# Altium schematic sheet Microphone_Amplifier.SchDoc
size A3; DocumentNumber: 4; SheetNumber: 2; SheetTotal: 18
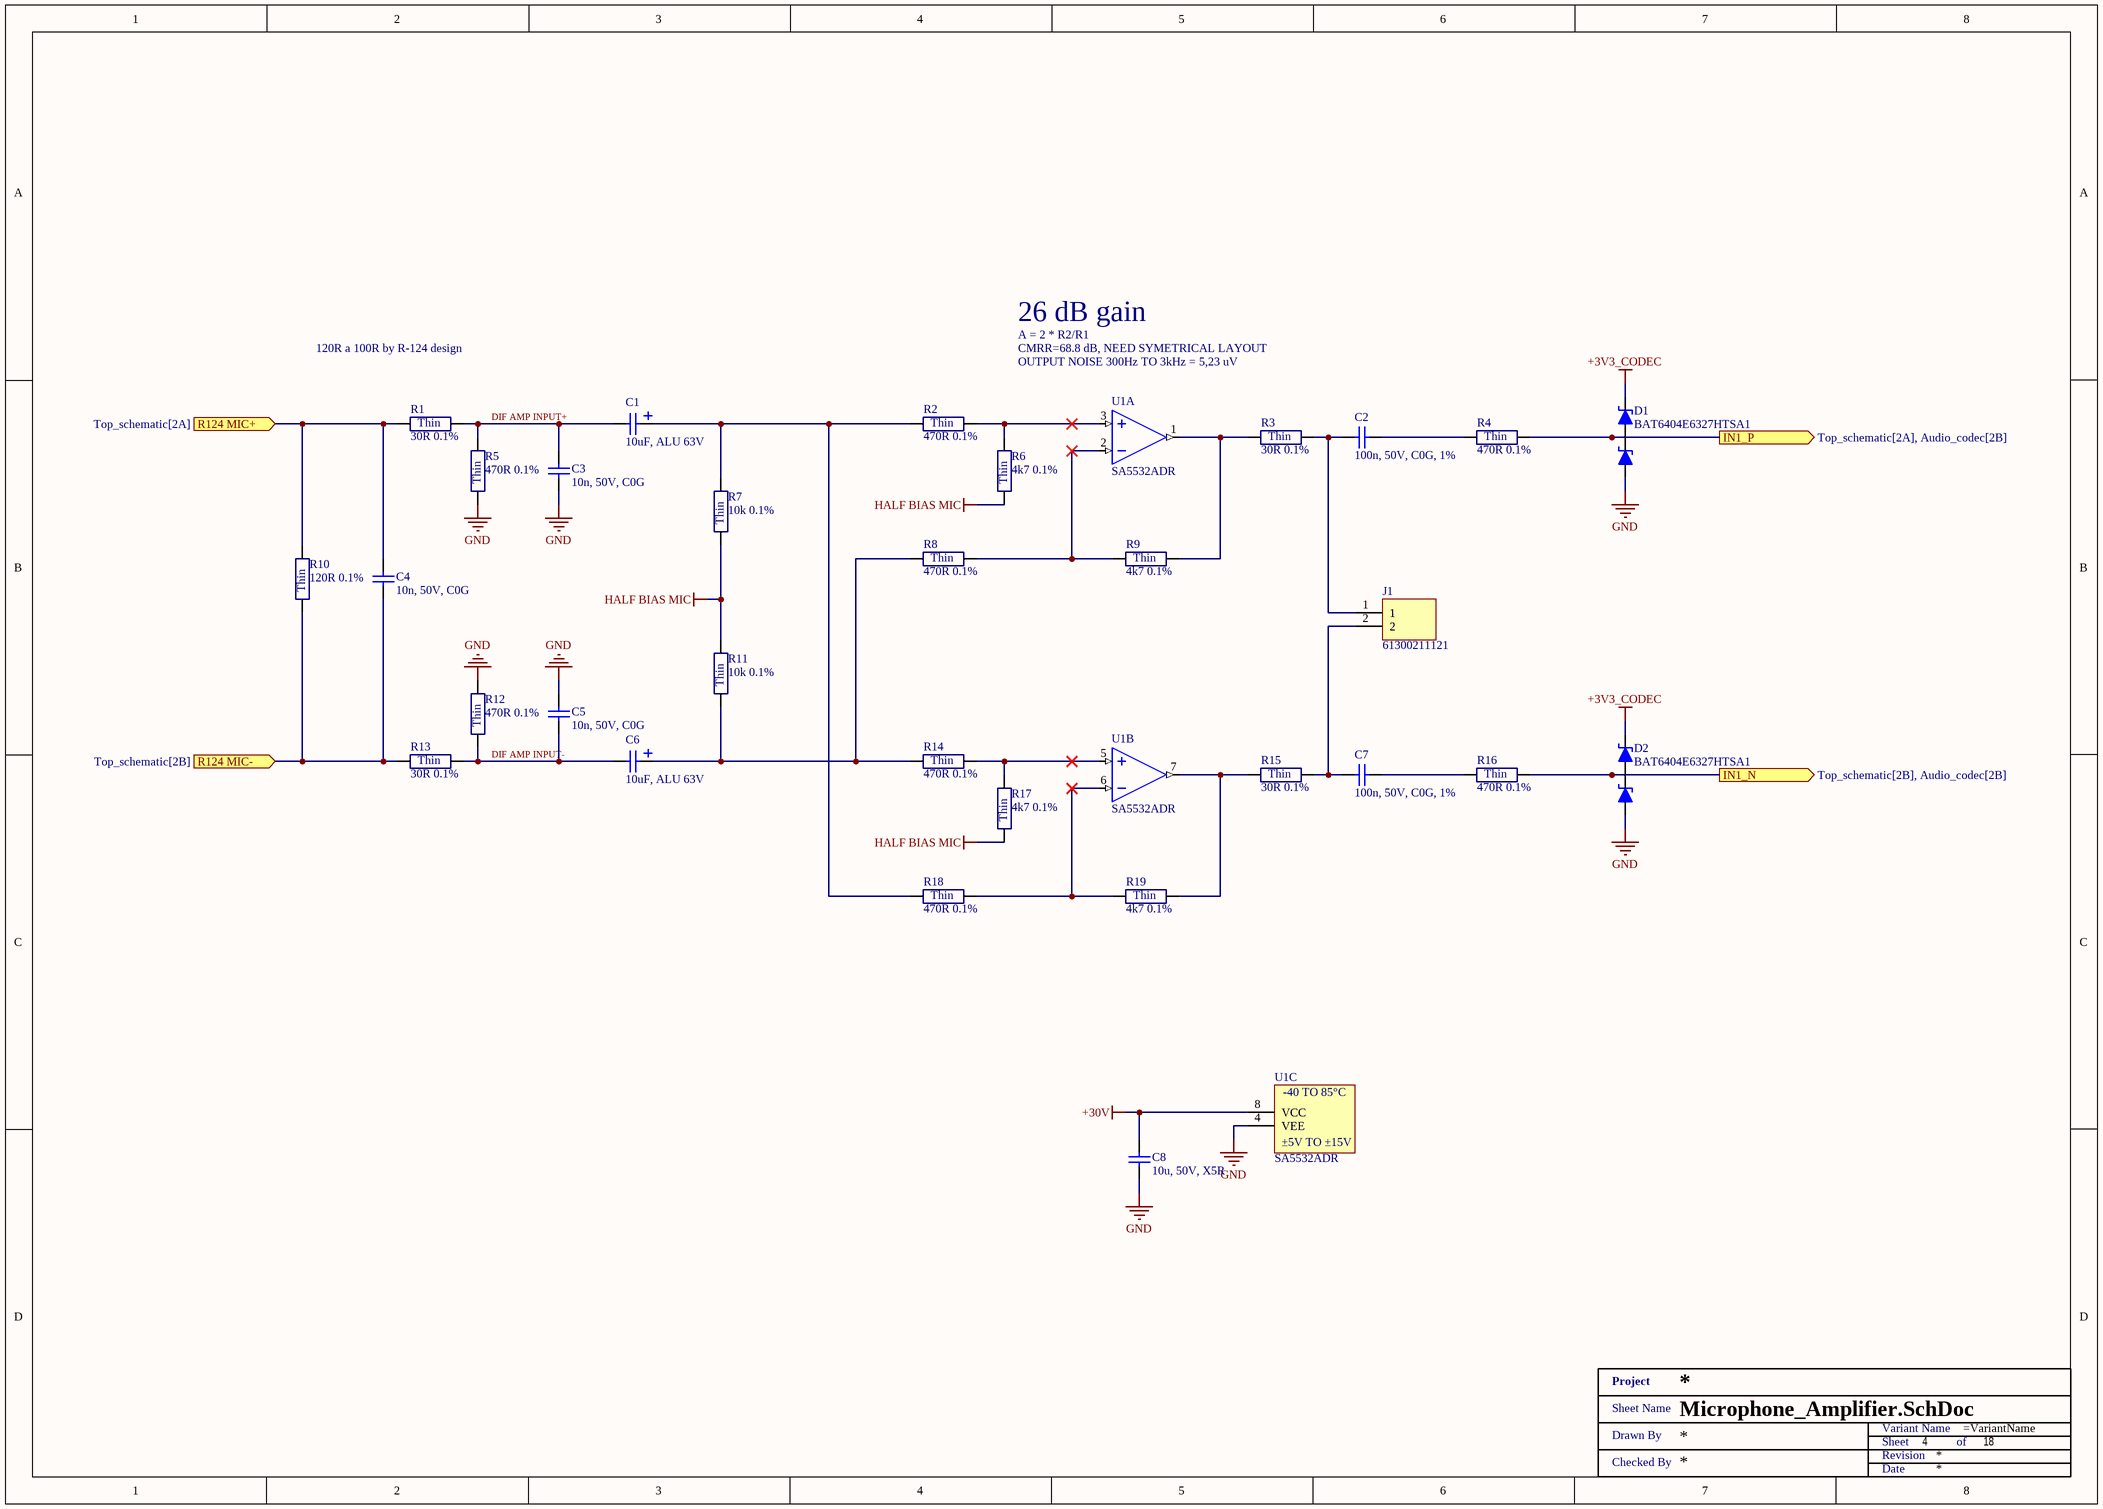
[diagram p0: Microphone_Amplifier.SchDoc]

## Parts
C1  10uF, ALU 63V  [WCAP-ATLI_5x11x2]
C2  100n, 50V, C0G, 1%  [SMD1206]
C3  10n, 50V, C0G  [SMD0603]
C4  10n, 50V, C0G  [SMD0603]
C5  10n, 50V, C0G  [SMD0603]
C6  10uF, ALU 63V  [WCAP-ATLI_5x11x2]
C7  100n, 50V, C0G, 1%  [SMD1206]
C8  10u, 50V, X5R  [SMD1206]
D1  BAT6404E6327HTSA1  [SOT23 (TO-236AB)]
D2  BAT6404E6327HTSA1  [SOT23 (TO-236AB)]
J1  61300211121  [Header 2 2.54mm]
R1  30R 0.1%  [SMD0402 - R]
R2  470R 0.1%  [SMD0402 - R]
R3  30R 0.1%  [SMD0402 - R]
R4  470R 0.1%  [SMD0402 - R]
R5  470R 0.1%  [SMD0402 - R]
R6  4k7 0.1%  [SMD0402 - R]
R7  10k 0.1%  [SMD0402 - R]
R8  470R 0.1%  [SMD0402 - R]
R9  4k7 0.1%  [SMD0402 - R]
R10  120R 0.1%  [SMD0402 - R]
R11  10k 0.1%  [SMD0402 - R]
R12  470R 0.1%  [SMD0402 - R]
R13  30R 0.1%  [SMD0402 - R]
R14  470R 0.1%  [SMD0402 - R]
R15  30R 0.1%  [SMD0402 - R]
R16  470R 0.1%  [SMD0402 - R]
R17  4k7 0.1%  [SMD0402 - R]
R18  470R 0.1%  [SMD0402 - R]
R19  4k7 0.1%  [SMD0402 - R]
U1  SA5532ADR  [SOIC08]  (parts A,B,C of 3)
XX?  Title 1  (value not drawn)  (graphical)

## Ports
IN1_N (out, see Top_schematic[2B], Audio_codec[2B]), IN1_P (out, see Top_schematic[2A], Audio_codec[2B]), R124 MIC+ (in, see Top_schematic[2A]), R124 MIC- (in, see Top_schematic[2B])

## Nets
+3V3_CODEC: D1.2(C) D2.2(C)
+30V: C8.2 U1.8(VCC)
GND: C3.1 C5.2 C8.1 D1.1(A) D2.1(A) R5.1 R12.2 U1.4(VEE)
HALF BIAS MIC: R6.1 R7.1 R11.2 R17.1
DIF AMP INPUT+: C1.2 C3.2 R1.2 R5.2
DIF AMP INPUT-: C5.1 C6.2 R12.1 R13.2
IN1_N: D2.3(C) R16.2 ; port IN1_N
IN1_P: D1.3(C) R4.2 ; port IN1_P
R124 MIC+: C4.2 R1.1 R10.2 ; port R124 MIC+
R124 MIC-: C4.1 R10.1 R13.1 ; port R124 MIC-
NetC1_1: C1.1 R2.1 R7.2 R18.1
NetC2_1: C2.1 J1.1 R3.2
NetC2_2: C2.2 R4.1
NetC6_1: C6.1 R8.1 R11.1 R14.1
NetC7_1: C7.1 J1.2 R15.2
NetC7_2: C7.2 R16.1
NetR2_2: R2.2 R6.2 U1.3(+IN_A)
NetR3_1: R3.1 R9.2 U1.1(OUT_A)
NetR8_2: R8.2 R9.1 U1.2(-IN_A)
NetR14_2: R14.2 R17.2 U1.5(+IN_B)
NetR15_1: R15.1 R19.2 U1.7(OUT_B)
NetR18_2: R18.2 R19.1 U1.6(-IN_B)

## Notes on the sheet
- 120R a 100R by R-124 design
- 26 dB gain
- A = 2 * R2/R1
- CMRR=68.8 dB, NEED SYMETRICAL LAYOUT
- OUTPUT NOISE 300Hz TO 3kHz = 5,23 uV
- (in symbol RT0402BRD074K7L) Thin
- (in symbol RT0402BRE07120RL) Thin
- (in symbol RT0402BRE07470RL) Thin
- (in symbol SA5532ADR, part C) -40 TO 85°C; ±5V TO ±15V
- (in symbol TC0225B300JTCC) Thin
- (in symbol TC0225B1002TCC) Thin
- (in symbol Title 1) Project; Sheet Name; Variant Name; Drawn By; Sheet; of; Revision; Checked By; Date

## Library data of the parts
C1 C6 = 860080772001: WURTH ELEKTRONIK - 860080772001 - CAP, ALU ELEC, 10UF, 63V, RADIAL; Ripple Current: 135mA @ 100kHz; Capacitance: 10u; Manufacturer: WURTH ELEKTRONIK; Manufacturer Part Number: 860080772001; RoHS: YES; Stock 1: 553; Pricing 1: 1=0.0957, 3=0.091, 5=0.0863, 10=0.0825, 20=0.0786, 50=0.0692, 250=0.0647, 500=0.0564 (GBP); ComponentLink1URL: http://www.farnell.com/datasheets/1879798.pdf; ComponentLink1Description: http://www.farnell.com/datasheets/1879798.pdf; Voltage Rating: 63V; Stock 3: 2136; Pricing 3: 1=0.62, 50=0.335, 100=0.289, 250=0.259, 500=0.235, 1500=0.202, 7500=0.182, 15000=0.178 (GBP); ComponentLink2URL: http://www.farnell.com/datasheets/2065186.pdf; ComponentLink2Description: http://www.farnell.com/datasheets/2065186.pdf; Supplier 1: Mouser; Supplier Part Number 1: 710-860080772001; Supplier 2: Farnell; Supplier Part Number 2: 2465955; Supplier 3: Digi-Key; Supplier Part Number 3: 732-9121-1-ND
C2 C7 = GCM31C5C1H104FA16L: CAP CER 0.1UF 50V C0G/NP0 1206 1%; Manufacturer: Murata; Supplier 1: Mouser; Supplier Part Number 1: 81-GCM31C5C1H104FA16; Manufacturer Part Number: GCM31C5C1H104FA16L; RoHS: No; Stock 1: 9381; Pricing 1: 1=1,24000, 10=0,98200, 25=0,90100, 100=0,73700, 250=0,59000, 500=0,55700 (USD); Supplier 2: Digi-Key; Supplier Part Number 2: 490-GCM31C5C1H104FA16LCT-ND; Supplier 3: Future Electronics; Supplier Part Number 3: GCM31C5C1H104FA16L-CUTT; Capacitance: 100n
C3-C5 = GRM1885C1H103JA01D: Multilayer Ceramic Capacitors MLCC - SMD/SMT 0603 50VDC 10000pF 5% C0G; Manufacturer: Murata Electronics; Type: Chip Multilayer Ceramic Capacitor for General Purpose; Capacitance - nF: 10 nF; Class: Class 1; CNHTS: 8532241000; Dielectric: C0G (NP0); TARIC: 8532240000; Supplier 1: Mouser; Supplier Part Number 1: 81-GRM1885C1H103JA1D; Manufacturer Part Number: GRM1885C1H103JA01D; RoHS: RoHS Compliant; Category: Multilayer Ceramic Capacitors MLCC - SMD/SMT; Stock 1: 217291; Pricing 1: 1=0.183, 10=0.129, 100=0.065, 500=0.045, 1000=0.039, 4000=0.030, 8000=0.027, 24000=0.025 (EUR); Capacitance: 10n; Height: 0.8 mm; Length: 1.6 mm; Package / Case: 0603 (1608 metric); Packaging: Cut Tape; Product: General Type MLCCs; Series: GRM; Termination Style: SMD/SMT; Tolerance: 5 %; Voltage Rating DC: 50 VDC; Width: 0.8 mm; Brand: Murata Electronics; Capacitance - pF: 10000 pF; Case Code - in: 0603; Case Code - mm: 1608; HTS Code: 8532240020; Maximum Operating Temperature: + 125 C; Minimum Operating Temperature: - 55 C; Product Type: Ceramic Capacitors; Standard Pack Qty: 4000; Subcategory: Capacitors; Termination: Standard; RoHS - Mouser: Y; Minimum Order Quantity: 1; Reeling: True; ComponentLink1URL: http://www.mouser.com/datasheet/2/281/murata_03052018_GRM_Series_1-1310166.pdf; ComponentLink1Description: http://www.mouser.com/datasheet/2/281/murata_03052018_GRM_Series_1-1310166.pdf; Supplier 2: Farnell; Supplier Part Number 2: 2456107
C8 = UMK316BBJ106KL-T: CAP CER 10UF 50V X5R 1206; Manufacturer: Taiyo Yuden; Tolerance: 10%; Supplier 1: Mouser; Supplier Part Number 1: 963-UMK316BBJ106KL-T; Manufacturer Part Number: UMK316BBJ106KL-T; RoHS: Yes; Category: Ceramic Capacitors; Stock 1: 207945; Pricing 1: 1=0,42000, 10=0,18000, 100=0,12800, 500=0,11000, 1000=0,09700, 2000=0,08000 (USD); Mount: Surface Mount; Case/Package: 1206; Min Operating Temperature: -55°C; Max Operating Temperature: 85°C; Packaging: Tape and Reel; Capacitance: 10u; Voltage Rating: 50V; Length: 0.126inch; Width: 0.063inch; Thickness: 0.071inch; Lead Free: Lead Free; ComponentLink1URL: http://ds.yuden.co.jp/TYCOMPAS/ut/detail.do?productNo=UMK316BBJ106KL-T&fileName=UMK316BBJ106KL-T_SS&mode=specSheetDownload&src-supplier=Digi-Key; ComponentLink1Description: http://ds.yuden.co.jp/TYCOMPAS/ut/detail.do?productNo=UMK316BBJ106KL-T&fileName=UMK316BBJ106KL-T_SS&mode=specSheetDownload&src-supplier=Digi-Key; ComponentLink2URL: https://www.yuden.co.jp/productdata/catalog/mlcc01_e.pdf?src-supplier=Digi-Key; ComponentLink2Description: https://www.yuden.co.jp/productdata/catalog/mlcc01_e.pdf?src-supplier=Digi-Key; ComponentLink3URL: http://www.yuden.co.jp/productdata/catalog/en/mlcc_all_e.pdf?src-supplier=Digi-Key; ComponentLink3Description: http://www.yuden.co.jp/productdata/catalog/en/mlcc_all_e.pdf?src-supplier=Digi-Key; Supplier 2: Digi-Key; Supplier Part Number 2: 587-5960-1-ND; Supplier 3: Avnet; Supplier Part Number 3: UMK316BBJ106KL-T
D1 D2 = BAT6404E6327HTSA1: Infineon 40V 250mA, Rectifier & Schottky Diode, SOT-23 BAT6404E6327HTSA1; Forward Voltage: 750mV; Peak Non-Repetitive Surge Current: 800mA; Reverse Recovery Time: 5ns; Average Rectified Current: 120mA; Value: 4pF; Element Configuration: Dual; Max Reverse Current: 2uA; Supplier 1: Mouser; Supplier Part Number 1: 726-BAT6404E6327HTSA; Manufacturer: Infineon; Manufacturer Part Number: BAT6404E6327HTSA1; RoHS: Yes; Category: Rectifier Diodes; Stock 1: 384914; Pricing 1: 1=0.15, 10=0.099, 50=0.099, 100=0.06, 1000=0.052, 10000=0.038 (USD); Mounting Technology: Surface Mount; Case/Package: SOT-23; Pins: 3; Min Operating Temperature: -55°C; Max Operating Temperature: 150°C; Packaging: Tape and Reel; Current Rating: 250mA; Voltage Rating (DC): 40V; Series: -; Max Reverse Voltage (DC): 40V; Max Forward Surge Current (Ifsm): 800mA; Package Quantity: 3000NUMBER; Reverse Voltage: 40V; Length: 2.9mm; Width: 1.3mm; Height: 1.1mm; Radiation Hardening: No; Lead Free: Lead Free; Halogen Free: Not Halogen Free; RoHS Compliant: Yes; Reach SVHC Compliant: 4186SVHC; ComponentLink1URL: https://datasheet.ciiva.com/3049/infineon-bat64series-ds-v01-01-en-3049368.pdf?src-supplier=Avnet; ComponentLink1Description: https://datasheet.ciiva.com/3049/infineon-bat64series-ds-v01-01-en-3049368.pdf?src-supplier=Avnet; ComponentLink2URL: https://datasheet.ciiva.com/6390/infineon-bat64series-ds-v01-01-en-6390184.pdf?src-supplier=Digikey; ComponentLink2Description: https://datasheet.ciiva.com/6390/infineon-bat64series-ds-v01-01-en-6390184.pdf?src-supplier=Digikey; ComponentLink3URL: https://datasheet.ciiva.com/6390/infineon-bat64series-ds-v01-01-en-6390183.pdf?src-supplier=Digikey; ComponentLink3Description: https://datasheet.ciiva.com/6390/infineon-bat64series-ds-v01-01-en-6390183.pdf?src-supplier=Digikey; ComponentLink4URL: https://datasheet.ciiva.com/8302/infineon-bat64series-ds-v01-01-en-8302938.pdf?src-supplier=Avnet; ComponentLink4Description: https://datasheet.ciiva.com/8302/infineon-bat64series-ds-v01-01-en-8302938.pdf?src-supplier=Avnet; Supplier 2: Farnell; Supplier Part Number 2: 2432680; Supplier 3: LCSC; Supplier Part Number 3: C513276; Supplier 4: TME; Supplier Part Number 4: BAT6404E6327HTSA1
J1 = 61300211121: CONN HEADER 2 POS 2.54; Manufacturer: Wurth Electronics Inc.; Pitch - Mating: 0.100" (2.54mm); Number of Positions: 2; Number of Positions Loaded: All; Style: Board to Board or Cable; Shrouding: Unshrouded; Contact Length - Mating: 0.236" (6.00mm); Contact Length - Post: 0.118" (3.00mm); Overall Contact Length: 0.454" (11.54mm); Material Flammability Rating: UL94 V-0; Current Rating: 3A; Voltage Rating: 250V; Manufacturer Part Number: 61300211121; RoHS: RoHS Compliant; Category: Connectors, Interconnects; Stock 1: 164911; Pricing 1: 1=0.13, 10=0.106, 25=0.088, 50=0.074, 100=0.067, 1000=0.061 (USD); Packaging: Bulk; Part Status: Active; Connector Type: Header; Contact Type: Male Pin; Number of Rows: 1; Row Spacing - Mating: -; Mounting Type: Through Hole; Termination: Solder; Fastening Type: Push-Pull; Insulation Height: 0.100" (2.54mm); Contact Shape: Square; Contact Finish - Mating: Gold; Contact Finish Thickness - Mating: -; Contact Finish - Post: -; Contact Material: Copper Alloy; Insulation Material: Polybutylene Terephthalate (PBT); Features: -; Operating Temperature: -40°C ~ 125°C; Ingress Protection: -; Insulation Color: Black; Mated Stacking Heights: -; Contact Finish Thickness - Post: -; Applications: -; ComponentLink1URL: https://katalog.we-online.de/em/datasheet/6130xx11121.pdf; ComponentLink1Description: https://katalog.we-online.de/em/datasheet/6130xx11121.pdf; Supplier 1: Mouser; Supplier Part Number 1: 710-61300211121; Supplier 2: Farnell; Supplier Part Number 2: 2356153; Supplier 3: Digi-Key; Supplier Part Number 3: 732-5315-ND
R1 R3 R13 R15 = TC0225B300JTCC: Resistor: thin film; SMD; 0402; 30Ω; 62.5mW; ±0.1%; TC25; 25V; -55÷155°C; Manufacturer: Uniroyal; Supplier 1: LCSC; Supplier Part Number 1: C50670254; Manufacturer Part Number: TC0225B300JTCC; Category: Uncategorized; Stock 1: 4950; Pricing 1: 50=0.0203, 500=0.0161, 1500=0.0137, 10000=0.0123, 20000=0.0111, 50000=0.0104 (USD); ComponentLink1URL: https://datasheet.octopart.com:443/TC0225B300JTCC-Uniroyal-datasheet-194228366.pdf?src-supplier=LCSC; ComponentLink1Description: https://datasheet.octopart.com:443/TC0225B300JTCC-Uniroyal-datasheet-194228366.pdf?src-supplier=LCSC; Resistance: 30R
R2 R4 R5 R8 R12 R14 R16 R18 = RT0402BRE07470RL: Fixed Resistor, Thin Film, 0.0625W, 470ohm, 50V, 0.1% +/-Tol, 50ppm/Cel, Surface Mount, 0402; Manufacturer: Yageo Group; Power Rating: 62.5mW; Temperature Coefficient: 50ppm/°C; Supplier: Mouser; Supplier Part Number: 603-RT0402BRE07470RL; Manufacturer Part Number: RT0402BRE07470RL; RoHS: Compliant; Category: Chip SMD Resistors; Pricing: 1=0,4, 10=0,205, 50=0,205, 100=0,121, 1000=0,079, 10000=0,052 (USD); Case/Package: 0402; Case Code (Metric): 0402; China RoHS: Non-Compliant; Composition: Thin Film; Country of Origin: Mainland China; Export Control Classification Number (ECCN) Code: EAR99; Height: 300µm; Harmonized Tariff Schedule (HTS) Code: 8533.21.00.30; Introduction Date: 2008-07-11; Lead Free: Lead Free; Length: 1mm; Lifecycle Status: Production; Max Operating Temperature: 155°C; Min Operating Temperature: -55°C; Mounting Technology: Surface Mount; Number of Terminals: 2; REACH SVHC: Yes; Value: 470R; Tolerance: 0.1%; Voltage Rating: 50V; Voltage Rating (DC): 50V; Width: 500µm; Working Voltage: 50V; ComponentLink1URL: https://datasheet.octopart.com:443/RT0402BRE07470RL-Yageo-datasheet-176402239.pdf?src-supplier=IHS; ComponentLink1Description: https://datasheet.octopart.com:443/RT0402BRE07470RL-Yageo-datasheet-176402239.pdf?src-supplier=IHS; ComponentLink2URL: https://datasheet.octopart.com:443/RT0402BRE07470RL-Yageo-datasheet-96443642.pdf?src-supplier=Upverter; ComponentLink2Description: https://datasheet.octopart.com:443/RT0402BRE07470RL-Yageo-datasheet-96443642.pdf?src-supplier=Upverter; ComponentLink3URL: https://datasheet.octopart.com:443/RT0402BRE07470RL-Yageo-Group-datasheet-188167888.pdf?src-supplier=LCSC; ComponentLink3Description: https://datasheet.octopart.com:443/RT0402BRE07470RL-Yageo-Group-datasheet-188167888.pdf?src-supplier=LCSC; ComponentLink4URL: https://datasheet.octopart.com:443/RT0402BRE07470RL-Yageo-Group-datasheet-141265893.pdf?src-supplier=ODG+(Origin+Data+Global); ComponentLink4Description: https://datasheet.octopart.com:443/RT0402BRE07470RL-Yageo-Group-datasheet-141265893.pdf?src-supplier=ODG+(Origin+Data+Global); ComponentLink5URL: https://datasheet.octopart.com/RT0402BRE07470RL-Yageo-datasheet-86813807.pdf; ComponentLink5Description: https://datasheet.octopart.com/RT0402BRE07470RL-Yageo-datasheet-86813807.pdf; ComponentLink6URL: http://sigma.octopart.com:80/conflict_mineral_statement/Yageo-company-3.pdf?src-supplier=Compliance+Statements; ComponentLink6Description: http://sigma.octopart.com:80/conflict_mineral_statement/Yageo-company-3.pdf?src-supplier=Compliance+Statements; ComponentLink7URL: http://sigma.octopart.com:80/rohs_statement/Yageo-company-2.pdf?src-supplier=Compliance+Statements; ComponentLink7Description: http://sigma.octopart.com:80/rohs_statement/Yageo-company-2.pdf?src-supplier=Compliance+Statements; Supplier 1: Mouser; Supplier Part Number 1: 603-RT0402BRE07470RL; Supplier 2: LCSC; Supplier Part Number 2: C853290
R6 R9 R17 R19 = RT0402BRD074K7L: 62.5mW Thin Film Resistor 50V ±25ppm/℃ ±0.1% 4.7kΩ 0402 Chip Resistor - Surface Mount ROHS; Manufacturer: Yageo Group; Max Power Dissipation: 63mW; Temperature Coefficient: 25ppm/°C; Supplier: Mouser; Supplier Part Number: 603-RT0402BRD074K7L; Manufacturer Part Number: RT0402BRD074K7L; RoHS: Compliant; Category: Chip SMD Resistors; Stock: 24860; Pricing: 1=0,1, 10=0,069, 50=0,069, 100=0,065, 1000=0,054, 10000=0,048 (USD); Case/Package: 0402; Case Code (Imperial): 0402; China RoHS: Non-Compliant; Composition: Thin Film; Depth: 500µm; Features: Moisture Resistant; Height: 300µm; Lead Free: Lead Free; Length: 1mm; Lifecycle Status: Production; Max Operating Temperature: 155°C; Military Standard: Not; Min Operating Temperature: -55°C; Mounting Technology: Surface Mount; Number of Terminals: 2; Number of Terminations: 2; Power Rating: 62.5mW; REACH SVHC: Yes; Schedule B: 8533210045, 8533210045|8533210045|8533210045|8533210045|8533210045; Termination: SMD/SMT; Tolerance: 0.1%; Voltage Rating: 50V; Voltage Rating (DC): 50V; Width: 500µm; Working Voltage: 50V; ComponentLink1URL: https://datasheet.octopart.com:443/RT0402BRD074K7L-Yageo-datasheet-176402239.pdf?src-supplier=Future+Electronics; ComponentLink1Description: https://datasheet.octopart.com:443/RT0402BRD074K7L-Yageo-datasheet-176402239.pdf?src-supplier=Future+Electronics; ComponentLink2URL: https://datasheet.octopart.com:443/RT0402BRD074K7L-Yageo-datasheet-169971040.pdf?src-supplier=Future+Electronics; ComponentLink2Description: https://datasheet.octopart.com:443/RT0402BRD074K7L-Yageo-datasheet-169971040.pdf?src-supplier=Future+Electronics; ComponentLink3URL: https://datasheet.octopart.com:443/RT0402BRD074K7L-Yageo-datasheet-166250672.pdf?src-supplier=Future+Electronics; ComponentLink3Description: https://datasheet.octopart.com:443/RT0402BRD074K7L-Yageo-datasheet-166250672.pdf?src-supplier=Future+Electronics; ComponentLink4URL: https://datasheet.octopart.com:443/RT0402BRD074K7L-Yageo-datasheet-136673517.pdf?src-supplier=Future+Electronics; ComponentLink4Description: https://datasheet.octopart.com:443/RT0402BRD074K7L-Yageo-datasheet-136673517.pdf?src-supplier=Future+Electronics; ComponentLink5URL: https://datasheet.octopart.com:443/RT0402BRD074K7L-Yageo-datasheet-137700930.pdf?src-supplier=Future+Electronics; ComponentLink5Description: https://datasheet.octopart.com:443/RT0402BRD074K7L-Yageo-datasheet-137700930.pdf?src-supplier=Future+Electronics; ComponentLink6URL: https://datasheet.octopart.com:443/RT0402BRD074K7L-Yageo-datasheet-96443642.pdf?src-supplier=Upverter; ComponentLink6Description: https://datasheet.octopart.com:443/RT0402BRD074K7L-Yageo-datasheet-96443642.pdf?src-supplier=Upverter; ComponentLink7URL: https://datasheet.octopart.com:443/RT0402BRD074K7L-Yageo-Group-datasheet-188167888.pdf?src-supplier=TME; ComponentLink7Description: https://datasheet.octopart.com:443/RT0402BRD074K7L-Yageo-Group-datasheet-188167888.pdf?src-supplier=TME; ComponentLink8URL: https://datasheet.octopart.com:443/RT0402BRD074K7L-Yageo-datasheet-164439670.pdf?src-supplier=Newark; ComponentLink8Description: https://datasheet.octopart.com:443/RT0402BRD074K7L-Yageo-datasheet-164439670.pdf?src-supplier=Newark; ComponentLink9URL: https://datasheet.octopart.com/RT0402BRD074K7L-Yageo-datasheet-86813807.pdf; ComponentLink9Description: https://datasheet.octopart.com/RT0402BRD074K7L-Yageo-datasheet-86813807.pdf; ComponentLink10URL: http://sigma.octopart.com:80/conflict_mineral_statement/Yageo-company-3.pdf?src-supplier=Compliance+Statements; ComponentLink10Description: http://sigma.octopart.com:80/conflict_mineral_statement/Yageo-company-3.pdf?src-supplier=Compliance+Statements; ComponentLink11URL: http://sigma.octopart.com:80/rohs_statement/Yageo-company-2.pdf?src-supplier=Compliance+Statements; ComponentLink11Description: http://sigma.octopart.com:80/rohs_statement/Yageo-company-2.pdf?src-supplier=Compliance+Statements; Supplier 1: Mouser; Supplier Part Number 1: 603-RT0402BRD074K7L; Supplier 2: LCSC; Supplier Part Number 2: C281778; Resistance: 4k7
R7 R11 = TC0225B1002TCC: Fixed Resistor, Thin Film, 0.0625W, 10000ohm, 50V, 0.1% +/-Tol, Surface Mount, 0402; Manufacturer: Uniroyal; Power Rating: 62.5mW; Supplier 1: LCSC; Supplier Part Number 1: C2989267; Manufacturer Part Number: TC0225B1002TCC; Category: Chip SMD Resistors; Stock 1: 10200; Pricing 1: 20=0.0396, 200=0.0352, 600=0.0327, 2000=0.0312, 10000=0.0299, 20000=0.0292 (USD); Case/Package: 0402; Composition: Thin Film; Export Control Classification Number (ECCN) Code: EAR99; Height: 300µm; Harmonized Tariff Schedule (HTS) Code: 8533.21.00.30; Length: 1mm; Lifecycle Status: Production; Max Operating Temperature: 155°C; Min Operating Temperature: -55°C; Mounting Technology: Surface Mount; Number of Terminals: 2; Resistance: 10k; Tolerance: 0.1%; Width: 500µm; Working Voltage: 50V; ComponentLink1URL: https://datasheet.octopart.com:443/TC0225B1002TCC-Uniroyal-datasheet-194228365.pdf?src-supplier=LCSC; ComponentLink1Description: https://datasheet.octopart.com:443/TC0225B1002TCC-Uniroyal-datasheet-194228365.pdf?src-supplier=LCSC
R10 = RT0402BRE07120RL: 63mW Thin Film Resistor ±50ppm/℃ ±0.1% 120Ω 0402 Chip Resistor - Surface Mount ROHS; Manufacturer: Yageo Group; Power Rating: 62.5mW; Temperature Coefficient: 50ppm/°C; Voltage Rating: 50V; Supplier: Mouser; Supplier Part Number: 603-RT0402BRE07120RL; Manufacturer Part Number: RT0402BRE07120RL; RoHS: Compliant; Category: Chip SMD Resistors; Pricing: 1=0,4, 10=0,205, 50=0,205, 100=0,121, 1000=0,079, 10000=0,052 (USD); Case/Package: 0402; Case Code (Metric): 0402; China RoHS: Non-Compliant; Composition: Thin Film; Height: 300µm; Lead Free: Lead Free; Length: 1mm; Lifecycle Status: Production; Max Operating Temperature: 155°C; Max Power Dissipation: 63mW; Min Operating Temperature: -55°C; Mounting Technology: Surface Mount; Number of Terminals: 2; Number of Terminations: 2; Packaging: Tape & Reel (TR); REACH SVHC: Yes; Resistance: 120R; Tolerance: 0.1%; Voltage Rating (DC): 50V; Width: 500µm; Working Voltage: 50V; ComponentLink1URL: https://datasheet.octopart.com:443/RT0402BRE07120RL-Yageo-datasheet-176402239.pdf?src-supplier=IHS; ComponentLink1Description: https://datasheet.octopart.com:443/RT0402BRE07120RL-Yageo-datasheet-176402239.pdf?src-supplier=IHS; ComponentLink2URL: https://datasheet.octopart.com:443/RT0402BRE07120RL-Yageo-datasheet-96443642.pdf?src-supplier=Upverter; ComponentLink2Description: https://datasheet.octopart.com:443/RT0402BRE07120RL-Yageo-datasheet-96443642.pdf?src-supplier=Upverter; ComponentLink3URL: https://datasheet.octopart.com:443/RT0402BRE07120RL-Yageo-Group-datasheet-141265893.pdf?src-supplier=ODG+(Origin+Data+Global); ComponentLink3Description: https://datasheet.octopart.com:443/RT0402BRE07120RL-Yageo-Group-datasheet-141265893.pdf?src-supplier=ODG+(Origin+Data+Global); ComponentLink4URL: https://datasheet.octopart.com/RT0402BRE07120RL-Yageo-datasheet-86813807.pdf; ComponentLink4Description: https://datasheet.octopart.com/RT0402BRE07120RL-Yageo-datasheet-86813807.pdf; ComponentLink5URL: http://sigma.octopart.com:80/conflict_mineral_statement/Yageo-company-3.pdf?src-supplier=Compliance+Statements; ComponentLink5Description: http://sigma.octopart.com:80/conflict_mineral_statement/Yageo-company-3.pdf?src-supplier=Compliance+Statements; ComponentLink6URL: http://sigma.octopart.com:80/rohs_statement/Yageo-company-2.pdf?src-supplier=Compliance+Statements; ComponentLink6Description: http://sigma.octopart.com:80/rohs_statement/Yageo-company-2.pdf?src-supplier=Compliance+Statements; Supplier 1: Mouser; Supplier Part Number 1: 603-RT0402BRE07120RL; Supplier 2: LCSC; Supplier Part Number 2: C853003
U1 = SA5532ADR: ROHS3Compliant EAR99 SA5532 Cut Tape (CT) op amp buffer circuit 4.9mm 200nA 4mV 10000kHz; Manufacturer: Texas Instruments; Manufacturer Lifecycle Status: ACTIVE; Bandwidth: 10MHz; Common Mode Rejection Ratio: 70dB; Input Bias Current: 800nA; Max Dual Supply Voltage: 15V; Min Dual Supply Voltage: 5V; Nominal Supply Current: 16mA; Number of Channels: 2; Operating Supply Current: 8mA; Output Current: 38mA; Slew Rate: 9V/µs; Voltage Gain: 100dB; Manufacturer Part Number: SA5532ADR; RoHS: Compliant; Category: Amplifiers - Op Amps, Buffer, Instrumentation; Pricing 1: 1=0.58, 10=0.405, 50=0.363, 100=0.316, 1000=0.269, 10000=0.249 (USD); Case/Package: SOIC; Contact Plating: Gold; Gain Bandwidth Product: 10MHz; Height: 1.75mm; Input Offset Voltage (Vos): 4mV; Lead Free: Lead Free; Length: 4.9mm; Lifecycle Status: Production; Max I/O Voltage: 4mV; Max Operating Temperature: 85°C; Max Supply Voltage: 15V; Min Operating Temperature: -40°C; Nominal Gain Bandwidth Product: 10MHz; Number of Circuits: 2; Number of Elements: 2; Pins: 8; Output Current per Channel: 38mA; Radiation Hardening: No; Schedule B: 8542330000, 8542330000|8542330000|8542330000|8542330000|8542330000; Thickness: 1.58mm; Width: 3.91mm; ComponentLink1URL: https://datasheet.octopart.com:443/SA5532ADR-Texas-Instruments-datasheet-41216652.pdf?src-supplier=Texas+Instruments; ComponentLink1Description: https://datasheet.octopart.com:443/SA5532ADR-Texas-Instruments-datasheet-41216652.pdf?src-supplier=Texas+Instruments; ComponentLink2URL: https://octopart.com:443/opatz8j6/c1?t=BMvzKz7-sj-S1-Dsr8DdYqdwvlAJ1p8EkRXKuSmmWP-6byp-ij1qjOCBNe3kiZ3VXcZV_2y_9BNtRyS6u4HeRxplgPa6tIscd6ONAd2o7cOSCVgEvHKbcW5aVa9TzAtJzxrLl3EL3jMW4_3-9hBLoKePFC9U6uwTHoowvK-6ULYqA_cqsAnRVsDlRoqy1hQQmhpGhdTdZRO1RoDh0uRfck1XzJnG1HhE6rhdpTgDPcT597XV8iSYx_kN_H9eCK8qNRRFOX_BOxK1gYE8mPq_MY-XmnDjgshG-IxPARb-O9C2qjigCjmd4F8ZlZv55EvB5eotoi6nSKHqH6N_VFx0jIAU0z77gYIUEADzPI9nLSljJ6AxAnNjNOtkzVrGTAn7ZMs&src-supplier=Texas+Instruments; ComponentLink2Description: https://octopart.com:443/opatz8j6/c1?t=BMvzKz7-sj-S1-Dsr8DdYqdwvlAJ1p8EkRXKuSmmWP-6byp-ij1qjOCBNe3kiZ3VXcZV_2y_9BNtRyS6u4HeRxplgPa6tIscd6ONAd2o7cOSCVgEvHKbcW5aVa9TzAtJzxrLl3EL3jMW4_3-9hBLoKePFC9U6uwTHoowvK-6ULYqA_cqsAnRVsDlRoqy1hQQmhpGhdTdZRO1RoDh0uRfck1XzJnG1HhE6rhdpTgDPcT597XV8iSYx_kN_H9eCK8qNRRFOX_BOxK1gYE8mPq_MY-XmnDjgshG-IxPARb-O9C2qjigCjmd4F8ZlZv55EvB5eotoi6nSKHqH6N_VFx0jIAU0z77gYIUEADzPI9nLSljJ6AxAnNjNOtkzVrGTAn7ZMs&src-supplier=Texas+Instruments; ComponentLink3URL: https://datasheet.octopart.com:443/SA5532ADR-Texas-Instruments-datasheet-10255165.pdf?src-supplier=Texas+Instruments; ComponentLink3Description: https://datasheet.octopart.com:443/SA5532ADR-Texas-Instruments-datasheet-10255165.pdf?src-supplier=Texas+Instruments; ComponentLink4URL: https://sigma.octopart.com:443/49249642/technical_drawing/Texas-Instruments-SA5532ADR.pdf?src-supplier=Texas+Instruments; ComponentLink4Description: https://sigma.octopart.com:443/49249642/technical_drawing/Texas-Instruments-SA5532ADR.pdf?src-supplier=Texas+Instruments; ComponentLink5URL: https://datasheet.octopart.com:443/SA5532ADR-Texas-Instruments-datasheet-150397.pdf?src-supplier=Texas+Instruments; ComponentLink5Description: https://datasheet.octopart.com:443/SA5532ADR-Texas-Instruments-datasheet-150397.pdf?src-supplier=Texas+Instruments; ComponentLink6URL: https://datasheet.octopart.com:443/SA5532ADR-Texas-Instruments-datasheet-37101722.pdf?src-supplier=Newark; ComponentLink6Description: https://datasheet.octopart.com:443/SA5532ADR-Texas-Instruments-datasheet-37101722.pdf?src-supplier=Newark; ComponentLink7URL: https://datasheet.octopart.com:443/SA5532ADR-Texas-Instruments-datasheet-83579903.pdf?src-supplier=Newark; ComponentLink7Description: https://datasheet.octopart.com:443/SA5532ADR-Texas-Instruments-datasheet-83579903.pdf?src-supplier=Newark; ComponentLink8URL: https://datasheet.octopart.com:443/SA5532ADR-Texas-Instruments-datasheet-27616440.pdf?src-supplier=Newark; ComponentLink8Description: https://datasheet.octopart.com:443/SA5532ADR-Texas-Instruments-datasheet-27616440.pdf?src-supplier=Newark; ComponentLink9URL: https://datasheet.octopart.com:443/SA5532ADR-Texas-Instruments-datasheet-21222538.pdf?src-supplier=Newark; ComponentLink9Description: https://datasheet.octopart.com:443/SA5532ADR-Texas-Instruments-datasheet-21222538.pdf?src-supplier=Newark; ComponentLink10URL: https://datasheet.octopart.com:443/SA5532ADR-Texas-Instruments-datasheet-165345935.pdf?src-supplier=LCSC; ComponentLink10Description: https://datasheet.octopart.com:443/SA5532ADR-Texas-Instruments-datasheet-165345935.pdf?src-supplier=LCSC; ComponentLink11URL: https://datasheet.octopart.com:443/SA5532ADR-Texas-Instruments-datasheet-159115543.pdf?src-supplier=LCSC; ComponentLink11Description: https://datasheet.octopart.com:443/SA5532ADR-Texas-Instruments-datasheet-159115543.pdf?src-supplier=LCSC; ComponentLink12URL: https://datasheet.octopart.com:443/SA5532ADR-Texas-Instruments-datasheet-164415849.pdf?src-supplier=SHENGYU+ELECTRONICS; ComponentLink12Description: https://datasheet.octopart.com:443/SA5532ADR-Texas-Instruments-datasheet-164415849.pdf?src-supplier=SHENGYU+ELECTRONICS; ComponentLink13URL: https://datasheet.octopart.com:443/SA5532ADR-Texas-Instruments-datasheet-14137414.pdf?src-supplier=iiiC; ComponentLink13Description: https://datasheet.octopart.com:443/SA5532ADR-Texas-Instruments-datasheet-14137414.pdf?src-supplier=iiiC; ComponentLink14URL: https://datasheet.octopart.com:443/SA5532ADR-Texas-Instruments-datasheet-43639.pdf?src-supplier=DigiKey; ComponentLink14Description: https://datasheet.octopart.com:443/SA5532ADR-Texas-Instruments-datasheet-43639.pdf?src-supplier=DigiKey; ComponentLink15URL: https://datasheet.octopart.com:443/SA5532ADR-Texas-Instruments-datasheet-114123.pdf?src-supplier=Sierra+IC; ComponentLink15Description: https://datasheet.octopart.com:443/SA5532ADR-Texas-Instruments-datasheet-114123.pdf?src-supplier=Sierra+IC; ComponentLink16URL: http://sigma.octopart.com:80/reach_statement/Texas-Instruments-company-64.pdf?src-supplier=Compliance+Statements; ComponentLink16Description: http://sigma.octopart.com:80/reach_statement/Texas-Instruments-company-64.pdf?src-supplier=Compliance+Statements; ComponentLink17URL: http://sigma.octopart.com:80/conflict_mineral_statement/Texas-Instruments-company-63.pdf?src-supplier=Compliance+Statements; ComponentLink17Description: http://sigma.octopart.com:80/conflict_mineral_statement/Texas-Instruments-company-63.pdf?src-supplier=Compliance+Statements; Supplier 1: Mouser; Supplier Part Number 1: 595-SA5532ADR; Supplier 2: LCSC; Supplier Part Number 2: C83716; Supplier 3: TME; Supplier Part Number 3: SA5532ADR